# Altium schematic sheet P1.schdoc
size 420 x 298 mm; Symbol: Sheet-Symbol_A3; Company: 嘉立创EDA; Version: V1.0; Page Size: A3; @Project Name: ESP32S3_DMX_RDM_2026-06-09; @Page Count: 1; @Update Date: 2026-08-19; @Create Date: 2026-08-19; @Schematic Name: Schematic1; @Page No: 1; @Page Name: P1; Device: Sheet-Symbol_A3
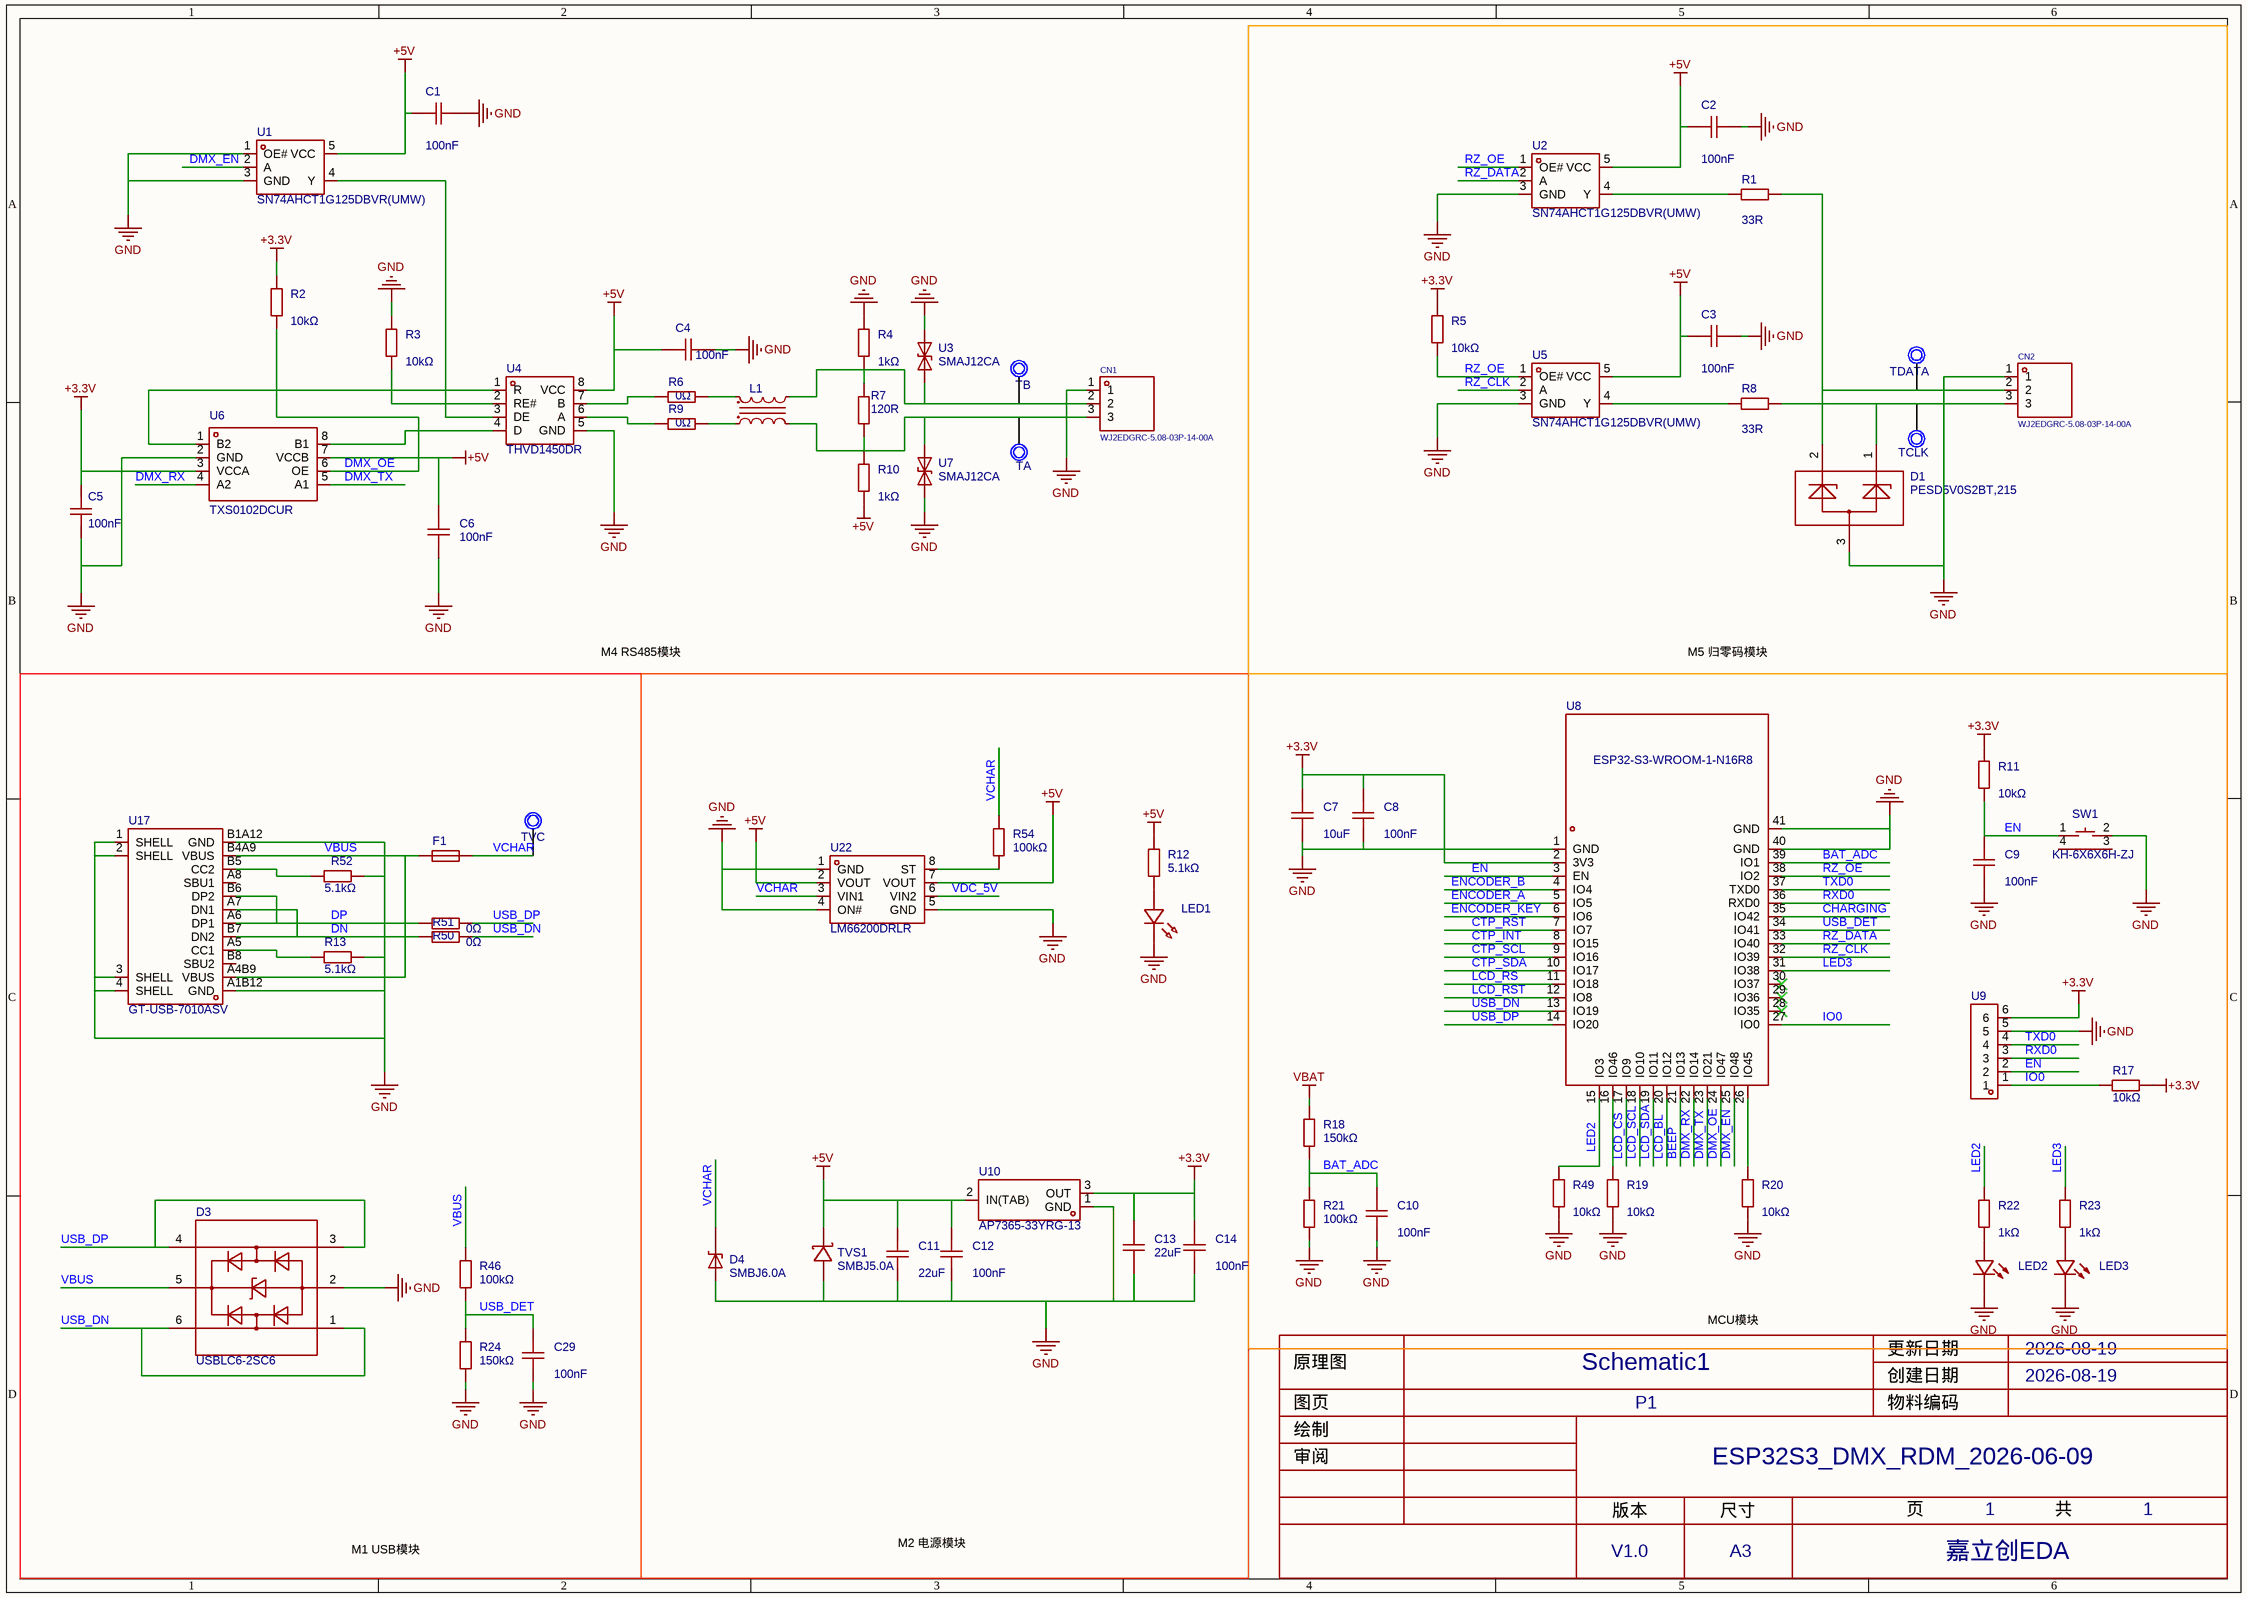
[diagram p0: P1.schdoc]

## Parts
C1  100nF  [C0805]
C2  100nF  [C0805]
C3  100nF  [C0805]
C4  100nF  [C0805]
C5  100nF  [C0805]
C6  100nF  [C0805]
C7  10uF  [C0805]
C8  100nF  [C0805]
C9  100nF  [C0805]
C10  100nF  [C0805]
C11  22uF  [C0805]
C12  100nF  [C0805]
C13  22uF  [C0805]
C14  100nF  [C0805]
C29  100nF  [C0805]
CN1  WJ2EDGRC-5.08-03P-14-00A  [CONN-TH_3P-P5.08_WJ2EDGRC-5.08-3P]
CN2  WJ2EDGRC-5.08-03P-14-00A  [CONN-TH_3P-P5.08_WJ2EDGRC-5.08-3P]
D1  PESD5V0S2BT,215  [SOT-23_L2.9-W1.3-P1.90-LS2.4-BR]
D3  USBLC6-2SC6  [SOT-23-6_L2.9-W1.6-P0.95-LS2.8-BL]
D4  SMBJ6.0A  [SMB_L4.5-W3.7-LS5.4-RD]
F1  1206L300SL16ARG  [L1206]  (value not drawn)
L1  SMW2012B900DTE  [FILTER-SMD_4P-L2.0-W1.2-BL]  (value not drawn)
LED1  MHK1375CRBTD  [LED-TH_MHK1375CRBTD]  (value not drawn)
LED2  MHK1375CGBTD  [LED-TH_MHK1375CGBTD]  (value not drawn)
LED3  MHK1375CGBTD  [LED-TH_MHK1375CGBTD]  (value not drawn)
R1  33R  [R0805]
R2  10kΩ  [R0805]
R3  10kΩ  [R0805]
R4  1kΩ  [R0805]
R5  10kΩ  [R0805]
R6  0Ω  [R0805]
R7  120R  [R0805]
R8  33R  [R0805]
R9  0Ω  [R0805]
R10  1kΩ  [R0805]
R11  10kΩ  [R0805]
R12  5.1kΩ  [R0805]
R13  5.1kΩ  [R0805]
R17  10kΩ  [R0805]
R18  150kΩ  [R0805]
R19  10kΩ  [R0805]
R20  10kΩ  [R0805]
R21  100kΩ  [R0805_NEW]
R22  1kΩ  [R0805]
R23  1kΩ  [R0805]
R24  150kΩ  [R0805]
R46  100kΩ  [R0805]
R49  10kΩ  [R0805]
R50  0Ω  [R0805]
R51  0Ω  [R0805]
R52  5.1kΩ  [R0805]
R54  100kΩ  [R0805]
SW1  KH-6X6X6H-ZJ  [SW-TH_KH-6X6X6H-ZJ-A]
TA  (no value)  [测试点]
TB  (no value)  [测试点]
TCLK  (no value)  [测试点]
TDATA  (no value)  [测试点]
TVC  (no value)  [测试点]
TVS1  SMBJ5.0A  [SMB_L4.6-W3.6-LS5.3-RD]
U1  SN74AHCT1G125DBVR(UMW)  [SOT-23-5_L3.0-W1.5-P0.95-LS2.8-BL]
U2  SN74AHCT1G125DBVR(UMW)  [SOT-23-5_L3.0-W1.5-P0.95-LS2.8-BL]
U3  SMAJ12CA  [SMA_L4.3-W2.7-LS5.1-BI]
U4  THVD1450DR  [SOIC-8_L4.9-W3.9-P1.27-LS6.0-BL]
U5  SN74AHCT1G125DBVR(UMW)  [SOT-23-5_L3.0-W1.5-P0.95-LS2.8-BL]
U6  TXS0102DCUR  [VSON8_L2.0-W2.3-P0.50-LS3.1-BL]
U7  SMAJ12CA  [SMA_L4.3-W2.7-LS5.1-BI]
U8  (no value)  [WIRELM-SMD_ESP32-S3-WROOM-1]
U9  LAIL-PZ2.54-6P-L  [CONN-TH_LAIL-PZ2.54-6P-L]  (value not drawn)
U10  AP7365-33YRG-13  [SOT-89-3_L4.5-W2.5-P1.50-LS4.2-BR]
U17  GT-USB-7010ASV  [USB-C-SMD_G-SWITCH_GT-USB-7010ASV]
U22  LM66200DRLR  [SOT-583-8_L2.1-W1.2-P0.50-LS1.6-BL]

## Blocks framed on the sheet
M5 归零码模块: C2 C3 CN2 D1 R1 R5 R8 TCLK TDATA U2 U5
M2 电源模块: C11-C14 D4 LED1 R12 R54 TVS1 U10 U22
MCU模块: C7-C10 LED2 LED3 R11 R17-R23 R49 SW1 U8 U9

## Nets
+3.3V: C5.2 C7.2 C8.2 C13.2 C14.2 R2.2 R5.2 R11.2 R17.2 U6.3(VCCA) U8.2(3V3) U9.6 U10.3(OUT)
+5V: C1.2 C2.2 C3.2 C4.1 C6.2 C11.2 C12.2 R10.1 R12.2 TVS1.1(K) U1.5(VCC) U2.5(VCC) U4.8(VCC) U5.5(VCC) U6.7(VCCB) U10.2(IN(TAB)) U22.2(VOUT) U22.7(VOUT)
GND: C1.1 C2.1 C3.1 C4.2 C5.1 C6.1 C7.1 C8.1 C9.1 C10.1 C11.1 C12.1 C13.1 C14.1 C29.1 CN1.1 CN2.1 D1.3 D3.2 D4.2(A) LED1.2(K) LED2.2(-) LED3.2(-) R3.2 R4.2 R13.2 R19.1 R20.1 R21.1 R24.1 R49.1 R52.2 SW1.2 TVS1.2(A) U1.1(OE#) U1.3(GND) U2.3(GND) U3.1(K) U4.5(GND) U5.3(GND) U6.2(GND) U7.1(K) U8.1(GND) U8.40(GND) U8.41(GND) U9.5 U10.1(GND) U17.1(SHELL) U17.2(SHELL) U17.3(SHELL) U17.4(SHELL) U17.A1B12(GND) U17.B1A12(GND) U22.1(GND) U22.4(ON#) U22.5(GND)
VBAT: R18.2
BAT_ADC: C10.2 R18.1 R21.2 U8.39(IO1)
BEEP: U8.21(IO13)
CHARGING: U8.35(IO42)
CTP_INT: U8.8(IO15)
CTP_RST: U8.7(IO7)
CTP_SCL: U8.9(IO16)
CTP_SDA: U8.10(IO17)
DMX_EN: U1.2(A) U8.25(IO48)
DMX_OE: R2.1 U6.6(OE) U8.24(IO47)
DMX_RX: U6.4(A2) U8.22(IO14)
DMX_TX: U6.5(A1) U8.23(IO21)
DN: R50.1 U17.A7(DN1) U17.B7(DN2)
DP: R51.2 U17.A6(DP1) U17.B6(DP2)
EN: C9.2 R11.1 SW1.1 U8.3(EN) U9.2
ENCODER_A: U8.5(IO5)
ENCODER_B: U8.4(IO4)
ENCODER_KEY: U8.6(IO6)
IO0: R17.1 U8.27(IO0) U9.1
LCD_BL: U8.20(IO12)
LCD_CS: U8.17(IO9)
LCD_RS: U8.11(IO18)
LCD_RST: U8.12(IO8)
LCD_SCL: U8.18(IO10)
LCD_SDA: U8.19(IO11)
LED2: R22.2 R49.2 U8.15(IO3)
LED3: R23.2 U8.31(IO38)
RXD0: U8.36(RXD0) U9.3
RZ_CLK: U5.2(A) U8.32(IO39)
RZ_DATA: U2.2(A) U8.33(IO40)
RZ_OE: R5.1 U2.1(OE#) U5.1(OE#) U8.38(IO2)
TXD0: U8.37(TXD0) U9.4
USB_DET: C29.2 R24.2 R46.1 U8.34(IO41)
USB_DN: D3.1 D3.6 R50.2 U8.13(IO19)
USB_DP: D3.3 D3.4 R51.1 U8.14(IO20)
VBUS: D3.5 F1.2 R46.2 U17.A4B9(VBUS) U17.B4A9(VBUS)
VCHAR: D4.1(K) F1.1 R54.2 TVC.1 U22.3(VIN1)
VDC_5V: U22.6(VIN2)
NetCN1_2: CN1.2 L1.4 R4.1 R7.2 TB.1 U3.2(A)
NetCN1_3: CN1.3 L1.3 R7.1 R10.2 TA.1 U7.2(A)
NetCN2_2: CN2.2 D1.2 R1.1 TDATA.1
NetCN2_3: CN2.3 D1.1 R8.1 TCLK.1
NetL1_1: L1.1 R6.1
NetL1_2: L1.2 R9.1
NetLED1_1: LED1.1(A) R12.1
NetLED2_1: LED2.1(+) R22.1
NetLED3_1: LED3.1(+) R23.1
NetR1_2: R1.2 U2.4(Y)
NetR3_1: R3.1 U1.4(Y) U4.2(RE#) U4.3(DE)
NetR6_2: R6.2 U4.7(B)
NetR8_2: R8.2 U5.4(Y)
NetR9_2: R9.2 U4.6(A)
NetR13_1: R13.1 U17.A5(CC1)
NetR19_2: R19.2 U8.16(IO46)
NetR20_2: R20.2 U8.26(IO45)
NetR52_1: R52.1 U17.B5(CC2)
NetR54_1: R54.1 U22.8(ST)
NetU4_1: U4.1(R) U6.1(B2)
NetU4_4: U4.4(D) U6.8(B1)

Not connected (* = marked no-connect by the designer): SW1 3 4; U8 28(IO35)* 29(IO36)* 30(IO37)*; U17 A8(SBU1) B8(SBU2)

## Notes on the sheet
- M4 RS485模块
- M1 USB模块
- 更新日期
- 2026-08-19
- 原理图
- 图页
- Schematic1
- P1
- 创建日期
- 物料编码
- 审阅
- 绘制
- ESP32S3_DMX_RDM_2026-06-09
- 版本
- V1.0
- 尺寸
- A3
- 页
- 1
- 嘉立创EDA
- 共

## Library data of the parts
C1-C6 C8-C10 C12 C14 C29 = CC0805KRX7R9BB104: 容值:100nF;精度:±10%;额定电压:50V;温度系数:X7R;; Manufacturer: YAGEO(国巨); Add into BOM: yes; Tolerance: ±10%; Voltage Rating: 50V; Temperature Coefficient: X7R; 3D Model: 1ba041120af144c991958decab20d241; 3D Model Transform: 78.74,51.181,0,0,0,0,0,0.0005,0; ModelName: C0805_L2.0-W1.3-H1.3; Symbol: CC0805KRX7R9BB104; Device: CC0805KRX7R9BB104; Convert to PCB: yes; LCSC Part Name: 100nF ±10% 50V; Supplier Part: C49678; Manufacturer Part: CC0805KRX7R9BB104; Supplier Footprint: 0805; JLCPCB Part Class: Basic Part; Datasheet: https://item.szlcsc.com/datasheet/CC0805KRX7R9BB104/50686.html; Supplier: LCSC; Value: 100nF; FootprintName: C0805
C7 = GRM21BR61C106KE15K: Manufacturer: muRata(村田); Add into BOM: yes; 3D Model: 1ba041120af144c991958decab20d2410819f05c4eef4c71ace90d822a990e87; 3D Model Transform: 78.74,51.181,0,0,0,0,0,0.0005,0; ModelName: C0805_L2.0-W1.3-H1.3; Symbol: GRM21BR61C106KE15K; Device: GRM21BR61C106KE15K; Convert to PCB: yes; Manufacturer Part: GRM21BR61C106KE15K; Supplier: LCSC; Supplier Part: GRM21BR61C106KE15K.1; Value: 10uF; FootprintName: C0805
C11 C13 = GRM21BR61A226ME51K: Manufacturer: muRata(村田); Add into BOM: yes; 3D Model: 1ba041120af144c991958decab20d2410819f05c4eef4c71ace90d822a990e87; 3D Model Transform: 78.74,51.181,0,0,0,0,0,0.0005,0; ModelName: C0805_L2.0-W1.3-H1.3; Symbol: GRM21BR61A226ME51K; Device: GRM21BR61A226ME51K; Convert to PCB: yes; Supplier Part: GRM21BR61A226ME51K.1; Manufacturer Part: GRM21BR61A226ME51K; Supplier: LCSC; Value: 22uF; FootprintName: C0805
CN1 CN2 = WJ2EDGRC-5.08-03P-14-00A: 连接器类型:板端/插座-闭口;固定方式:卡扣固定;结构:1x3P;间距:5.08mm;颜色:绿色;安装方式:弯插;排数:1;每排PIN数:3;额定电流:10A;额定电压:300V;线规 - AWG:-;线规 - 平方毫米:-;工作温度:-40℃~+105℃;; Manufacturer: KANGNEX(康奈克斯电气); Symbol: WJ2EDGRC-5.08-3P_C8377; Add into BOM: yes; Number of Positions or Pins: 1x3P; Pitch: 5.08mm; Number of PINs Per Row: 3; Current Rating: 10A; Voltage Rating (Max): 300V; 3D Model: 325b52b3465b4a359dace59af1924d21; 3D Model Transform: 674.802,480.314,0,0,0,0,0,-173.228,-157.48; ModelName: CONN-TH_WJ5.08-WI-3P-4; Device: WJ2EDGRC-5.08-03P-14-00A; Convert to PCB: yes; LCSC Part Name: 卡扣固定 1x3P 5.08mm 排数:1 每排P数:3; Supplier Part: C8377; Manufacturer Part: WJ2EDGRC-5.08-03P-14-00A; Supplier Footprint: 弯插,P=5.08mm; JLCPCB Part Class: Extended Part; Datasheet: https://item.szlcsc.com/datasheet/WJ2EDGRC-5.08-03P-14-00A/8871.html; Supplier: LCSC; Connector Type: 板端/插座-闭口; Termination Style: 卡扣固定; Color: 绿色; Mounting Type: 弯插; Number of Pins: 3P; Number of Rows: 1; Operating Temperature: -40℃~+105℃; Wire Gauge - AWG: -; Wire Gauge - mm2: -; Connection Type: -; Outlet Direction (Vertical Basis): -; FootprintName: CONN-TH_3P-P5.08_WJ2EDGRC-5.08-3P
D1 = PESD5V0S2BT,215: 极性:双向;反向截止电压(Vrwm):5V;钳位电压:14V;峰值脉冲电流(Ipp):12A;峰值脉冲功率(Ppp):130W@8/20us;击穿电压:5.5V;; Manufacturer: Nexperia(安世); 3D Model: c62791f0466c4ae2a892c056b845b0ca0819f05c4eef4c71ace90d822a990e87; 3D Model Transform: 98.64468,114.173,0,180,0,0,0.001,-0.002,0; Polarity: 双向; Reverse Stand-Off Voltage (Vrwm): 5V; Clamping Voltage: 14V; Peak Pulse Current (Ipp): 12A; Voltage - Breakdown: 5.5V; Reverse Leakage Current (Ir): 5nA; Number of Channels: 双路; level of protection: IEC 61000-4-5；IEC 61000-4-2; Type: ESD; Junction Capacitance: 35pF; AddInBom: yes; ModelName: SOT-23-3P_L2.9-W1.3-H1.0-LS2.4-P0.95; Symbol: PESD5V0S2BT,215; Device: PESD5V0S2BT,215; LCSC Part Name: 双向ESD; Supplier Part: C49338; Manufacturer Part: PESD5V0S2BT,215; Supplier Footprint: SOT-23; JLCPCB Part Class: Extended Part; Datasheet: https://item.szlcsc.com/datasheet/PESD5V0S2BT%252C215/50346.html; Supplier: LCSC; Peak Pulse Power Dissipation (Ppp): 130W@8/20us; ConvertToPcb: yes; FootprintName: SOT-23_L2.9-W1.3-P1.90-LS2.4-BR
D3 = USBLC6-2SC6_C7519: Manufacturer: ST(意法半导体); Add into BOM: yes; 3D Model: 18da8f6c14a34920b3e136b5c401a1190819f05c4eef4c71ace90d822a990e87; 3D Model Transform: 110.236,113.364,0,90,0,0,0.0005,0.0005,0; ModelName: SOT-23-6_L2.9-W1.6-H1.5-LS2.8-P0.95; Symbol: USBLC6-2SC6; Device: USBLC6-2SC6_C7519; Convert to PCB: yes; Supplier Part: USBLC6-2SC6.1; Manufacturer Part: USBLC6-2SC6; Supplier: LCSC; FootprintName: SOT-23-6_L2.9-W1.6-P0.95-LS2.8-BL
D4 = SMBJ6.0A_C3001967: 极性:单向;反向截止电压(Vrwm):6V;钳位电压:10.3V;峰值脉冲电流(Ipp):58.3A;峰值脉冲功率(Ppp):600W@10/1000us;击穿电压(VBR):6.67V;; Manufacturer: UMW(友台半导体); Add into BOM: yes; 3D Model: d1ae687a48d348b48f68a1373d83ebeb; 3D Model Transform: 212.598,144.488,0,0,0,0,0,0,0; Polarity: 单向; Reverse Stand-Off Voltage (Vrwm): 6V; Clamping Voltage: 10.3V; Peak Pulse Current (Ipp): 58.3A; Voltage - Breakdown: 6.67V; Reverse Leakage Current (Ir): 800uA; Number of Channels: 单路; level of protection: IEC 61000-4-4；IEC 61000-4-2; Type: TVS; Symbol: SMBJ6.0A_C3001967; Device: SMBJ6.0A_C3001967; Convert to PCB: yes; LCSC Part Name: 双向TVS 6V截止 峰值浪涌电流：58.3A; Supplier Part: C3001967; Manufacturer Part: SMBJ6.0A; Supplier Footprint: SMB(DO-214AA); JLCPCB Part Class: Extended Part; Datasheet: https://item.szlcsc.com/datasheet/SMBJ6.0A/3486674.html; Supplier: LCSC; Peak Pulse Power Dissipation (Ppp): 600W@10/1000us; Operating Temperature: -55℃~+150℃; Junction Capacitance: -; FootprintName: SMB_L4.5-W3.7-LS5.4-RD; ModelName: SMB_L4.5-W3.7-LS5.4-RD
F1 = 1206L300SL16ARG: 耐压(Vmax):16V;最大电流(Imax):50A;保持电流(Ihold):3A;跳闸电流(Itrip):6A;; Manufacturer: LUTE(陆特); Add into BOM: yes; 3D Model: 85bdab7b3d4c4074b81d208eb5e865b3; 3D Model Transform: 125.984,62.835,0,0,0,0,0,0,0; Hold Current: 3A; Trip Current: 6A; Power Dissipation: 1.2W; Resistance - Initial (Ri) (Min): 3mΩ; Resistance - Post Trip (R1) (Max): 30mΩ; Voltage - Max: 16V; Current - Max: 50A; Time to Trip(Max): 5s; ModelName: L1206_L3.2-W1.6-H1.1; Symbol: 1206L300SL16ARG; Device: 1206L300SL16ARG; Convert to PCB: yes; LCSC Part Name: 16V 3.00A 1206 低电阻自恢复自恢复; Supplier Part: C28326707; Manufacturer Part: 1206L300SL16ARG; Supplier Footprint: 1206; JLCPCB Part Class: Extended Part; Datasheet: https://item.szlcsc.com/datasheet/1206L300SL16ARG/30063183.html; Supplier: LCSC; Operating Temperature: -40℃~+85℃; Length: 3.5mm; Width: 1.85mm; Height: 1.2mm; Pitch: -; FootprintName: L1206
L1 = SMW2012B900DTE: 通道数:2;阻抗@频率:90Ω@100MHz;直流电阻(DCR):300mΩ;; Manufacturer: Sunltech(顺磁); Add into BOM: yes; Number of Lines: 2; Current Rating: 400mA; Voltage Rating - DC: 50V; Voltage Withstand: 125V; DC Resistance(DCR): 300mΩ; 3D Model: 2ee9896fb24849a1ae3ad995e0a10c07; 3D Model Transform: 79.527,47.244,0,90,0,0,0,0,0; ModelName: SMD-4_L2.0-W1.2-H1.3; Symbol: SMW2012B900DTE; Device: SMW2012B900DTE; Convert to PCB: yes; Manufacturer Part: SMW2012B900DTE; Supplier: LCSC; Supplier Part: C206236; LCSC Part Name: 两路 0805共模滤波器 阻抗90Ω@100MHz; Supplier Footprint: SMD-4P,2x1.2mm; JLCPCB Part Class: Extended Part; Datasheet: https://item.szlcsc.com/datasheet/SMW2012B900DTE/207281.html; Impedance @ Frequency: 90Ω@100MHz; Operating Temperature: -25℃~+85℃; FootprintName: FILTER-SMD_4P-L2.0-W1.2-BL
LED1 = MHK1375CRBTD: 灯头类型:-;发光颜色:红色;正向压降(Vf):2.05V;功率:75mW;正向电流:20mA;波长:628nm;二极管配置:-;透镜颜色:雾状红透镜;色温:-;发光角度:60°;载带方式:-;工作温度:-25℃~+85℃;; Manufacturer: MEIHUA(美华); 3D Model: 423a1abf1405417fac1227351b7df8de; 3D Model Transform: 181.102,334.645,0,0,0,0,0,-98.701,-137.795; Illumination Color: 红色; Voltage - Forward(Vf): 2.05V; Power(Watts): 75mW; Forward Current: 20mA; Wavelength - Dominant: 628nm; Lens Color: 雾状红透镜; Viewing Angle: 60°; AddInBom: yes; Symbol: MHK1375CRBTD; Device: MHK1375CRBTD; LCSC Part Name: 红灯; Supplier Part: C2764901; Manufacturer Part: MHK1375CRBTD; Supplier Footprint: 插件,P=2.54mm; JLCPCB Part Class: 扩展库; Datasheet: https://item.szlcsc.com/datasheet/MHK1375CRBTD/2899589.html; Supplier: LCSC; Lamp Holder Type: -; Peak Wavelength: -; Diode Configuration: -; Color Temperature: -; Mounting Style: -; Operating Temperature: -25℃~+85℃; ConvertToPcb: yes; FootprintName: LED-TH_MHK1375CRBTD; ModelName: LED-TH_MHK1375CRBTD
LED2 LED3 = MHK1375CGBTD: 灯头类型:组装式圆形灯头;发光颜色:黄绿色;功率:78mW;正向电流:20mA;主波长:568nm;二极管配置:-;透镜颜色:雾状绿透镜;色温:-;发光角度:80°;载带方式:-;工作温度:-25℃~+85℃;; Manufacturer: MEIHUA(美华); 3D Model: 6d9e9115b75148aea1bd7bdffe9c55de; 3D Model Transform: 181.102,334.645,0,0,0,0,0,-98.425,-137.795; Emitted Color: 黄绿色; Power Dissipation: 78mW; Forward Current: 20mA; Dominant Wavelength: 568nm; Lens Color: 雾状绿透镜; Viewing Angle: 80°; AddInBom: yes; ModelName: LED-TH_2P-L4.6-W8.5-H7.4-P2.54; Symbol: MHK1375CGBTD; Device: MHK1375CGBTD; LCSC Part Name: 普绿/黄绿; Supplier Part: C409769; Manufacturer Part: MHK1375CGBTD; Supplier Footprint: 插件,P=2.54mm; JLCPCB Part Class: 扩展库; Datasheet: https://atta.szlcsc.com/upload/public/pdf/source/20190807/C409769_BD2FEBD402124B53381C1A24DEF8BEC4.pdf; Supplier: LCSC; Lamp Holder Type: 组装式圆形灯头; Peak Wavelength: -; Diode Configuration: -; Color Temperature: -; Mounting Sytle: -; Operating Temperature: -25℃~+85℃; ConvertToPcb: yes; FootprintName: LED-TH_MHK1375CGBTD
R1 R8 = RC0805FR-0733RL: Manufacturer: YAGEO(国巨); Add into BOM: yes; 3D Model: 37a81e68749a4138bd2dfa6897b24b850819f05c4eef4c71ace90d822a990e87; 3D Model Transform: 78.74,51.181,0,0,0,0,0,-0.0005,0; ModelName: R0805_L2.0-W1.3-H0.6; Symbol: RC0805FR-0733RL; Device: RC0805FR-0733RL; Convert to PCB: yes; Supplier Part: RC0805FR-0733RL.1; Manufacturer Part: RC0805FR-0733RL; Supplier: LCSC; Value: 33R; FootprintName: R0805
R2 R3 R5 R11 R17 R19 R20 R49 = RC0805JR-0710KL: 电阻类型:厚膜电阻;阻值:10kΩ;精度:±5%;功率:125mW;最大工作电压:150V;温度系数:±100ppm/℃;; Manufacturer: YAGEO(国巨); Add into BOM: yes; Tolerance: ±5%; Power(Watts): 125mW; 3D Model: 37a81e68749a4138bd2dfa6897b24b85; 3D Model Transform: 78.74,51.181,0,0,0,0,0,-0.0005,0; Overload Voltage (Max): 150V; ModelName: R0805_L2.0-W1.3-H0.6; Symbol: RC0805JR-0710KL; Device: RC0805JR-0710KL; Convert to PCB: yes; LCSC Part Name: 厚膜电阻 10kΩ ±5% 125mW; Supplier Part: C100047; Manufacturer Part: RC0805JR-0710KL; Supplier Footprint: 0805; JLCPCB Part Class: Extended Part; Datasheet: https://atta.szlcsc.com/upload/public/pdf/source/20170708/1499509500945.pdf; Supplier: LCSC; Type: 厚膜电阻; Value: 10kΩ; Temperature Coefficient: ±100ppm/℃; Operating Temperature Range: -55℃~+155℃; FootprintName: R0805
R4 R10 = RC0805JR-071KL: 电阻类型:厚膜电阻;阻值:1kΩ;精度:±5%;功率:125mW;最大工作电压:150V;温度系数:±100ppm/℃;; Manufacturer: YAGEO(国巨); Add into BOM: yes; Tolerance: ±5%; Power(Watts): 125mW; Overload Voltage (Max): 150V; 3D Model: 37a81e68749a4138bd2dfa6897b24b85; 3D Model Transform: 78.74,51.181,0,0,0,0,0,-0.0005,0; ModelName: R0805_L2.0-W1.3-H0.6; Symbol: RC0805JR-071KL; Device: RC0805JR-071KL; Convert to PCB: yes; LCSC Part Name: 厚膜电阻 1kΩ ±5% 125mW; Supplier Part: C100046; Manufacturer Part: RC0805JR-071KL; Supplier Footprint: 0805; JLCPCB Part Class: Extended Part; Datasheet: https://atta.szlcsc.com/upload/public/pdf/source/20170708/1499509500945.pdf; Supplier: LCSC; Type: 厚膜电阻; Value: 1kΩ; Temperature Coefficient: ±100ppm/℃; Operating Temperature Range: -55℃~+155℃; FootprintName: R0805
R6 R9 R50 R51 = RC0805FR-070RL: 电阻类型:厚膜电阻;阻值:0Ω;精度:±1%;功率:125mW;工作电压:150V;温度系数:-;; Manufacturer: YAGEO(国巨); Add into BOM: yes; Tolerance: ±1%; Power(Watts): 125mW; 3D Model: 37a81e68749a4138bd2dfa6897b24b85; 3D Model Transform: 78.74,51.181,0,0,0,0,0,-0.0005,0; Voltage-Supply(Max): 150V; ModelName: R0805_L2.0-W1.3-H0.6; Symbol: RC0805FR-070RL; Device: RC0805FR-070RL; Convert to PCB: yes; Manufacturer Part: RC0805FR-070RL; Supplier: LCSC; Supplier Part: C100045; LCSC Part Name: 厚膜电阻 0Ω ±1% 125mW; Supplier Footprint: 0805; JLCPCB Part Class: Extended Part; Datasheet: https://item.szlcsc.com/datasheet/RC0805FR-070RL/101259.html; Type: 厚膜电阻; Value: 0Ω; Temperature Coefficient: -; Operating Temperature: -55℃~+155℃; FootprintName: R0805
R7 = RC0805FR-07120RL: Manufacturer: YAGEO(国巨); Add into BOM: yes; 3D Model: 37a81e68749a4138bd2dfa6897b24b850819f05c4eef4c71ace90d822a990e87; 3D Model Transform: 78.74,51.181,0,0,0,0,0,-0.0005,0; ModelName: R0805_L2.0-W1.3-H0.6; Symbol: RC0805FR-07120RL; Device: RC0805FR-07120RL; Convert to PCB: yes; Supplier Part: RC0805FR-07120RL.1; Manufacturer Part: RC0805FR-07120RL; Supplier: LCSC; Value: 120R; FootprintName: R0805
R12 = RC0805FR-075K1L: 电阻类型:厚膜电阻;阻值:5.1kΩ;精度:±1%;功率:125mW;工作电压:150V;温度系数:±100ppm/℃;; Manufacturer: YAGEO(国巨); Add into BOM: yes; Tolerance: ±1%; Power(Watts): 125mW; 3D Model: 37a81e68749a4138bd2dfa6897b24b85; 3D Model Transform: 78.74,51.181,0,0,0,0,0,-0.0005,0; Voltage-Supply(Max): 150V; ModelName: R0805_L2.0-W1.3-H0.6; Symbol: RC0805FR-075K1L; Device: RC0805FR-075K1L; Convert to PCB: yes; LCSC Part Name: 厚膜电阻 5.1kΩ ±1% 125mW; Supplier Part: C84375; Manufacturer Part: RC0805FR-075K1L; Supplier Footprint: 0805; JLCPCB Part Class: Extended Part; Datasheet: https://item.szlcsc.com/datasheet/RC0805FR-075K1L/85545.html; Supplier: LCSC; Type: 厚膜电阻; Value: 5.1kΩ; Temperature Coefficient: ±100ppm/℃; Operating Temperature: -55℃~+155℃; FootprintName: R0805
R13 R52 = RC0805FR-075K1L: 电阻类型:厚膜电阻;阻值:5.1kΩ;精度:±1%;功率:125mW;工作电压:150V;温度系数:±100ppm/℃;; Manufacturer: YAGEO(国巨); 3D Model: 37a81e68749a4138bd2dfa6897b24b850819f05c4eef4c71ace90d822a990e87; 3D Model Transform: 78.74,51.181,0,0,0,0,0,-0.0005,0; Tolerance: ±1%; Power(Watts): 125mW; Voltage-Supply(Max): 150V; AddInBom: yes; ModelName: R0805_L2.0-W1.3-H0.6; Symbol: RC0805FR-075K1L; Device: RC0805FR-075K1L; LCSC Part Name: 厚膜电阻 5.1kΩ ±1% 125mW; Supplier Part: C84375; Manufacturer Part: RC0805FR-075K1L; Supplier Footprint: 0805; JLCPCB Part Class: Extended Part; Datasheet: https://item.szlcsc.com/datasheet/RC0805FR-075K1L/85545.html; Supplier: LCSC; Type: 厚膜电阻; Value: 5.1kΩ; Temperature Coefficient: ±100ppm/℃; Operating Temperature: -55℃~+155℃; ConvertToPcb: yes; FootprintName: R0805
R18 R24 = RC0805FR-07150KL: 电阻类型:厚膜电阻;阻值:150kΩ;精度:±1%;功率:125mW;工作电压:150V;温度系数:±100ppm/℃;; Manufacturer: YAGEO(国巨); 3D Model: 37a81e68749a4138bd2dfa6897b24b850819f05c4eef4c71ace90d822a990e87; 3D Model Transform: 78.74,51.181,0,0,0,0,0,-0.0005,0; Tolerance: ±1%; Power(Watts): 125mW; Voltage-Supply(Max): 150V; AddInBom: yes; ModelName: R0805_L2.0-W1.3-H0.6; Symbol: RC0805FR-07150KL; Device: RC0805FR-07150KL; LCSC Part Name: 厚膜电阻 150kΩ ±1% 125mW; Supplier Part: C114558; Manufacturer Part: RC0805FR-07150KL; Supplier Footprint: 0805; JLCPCB Part Class: Extended Part; Datasheet: https://item.szlcsc.com/datasheet/RC0805FR-07150KL/115802.html; Supplier: LCSC; Type: 厚膜电阻; Value: 150kΩ; Temperature Coefficient: ±100ppm/℃; Operating Temperature: -55℃~+155℃; ConvertToPcb: yes; FootprintName: R0805
R21 = RC0805FR-07100KL: 电阻类型:厚膜电阻;阻值:100kΩ;精度:±1%;功率:125mW;工作电压:150V;温度系数:±100ppm/℃;; Manufacturer: YAGEO(国巨); Add into BOM: yes; 3D Model: 37a81e68749a4138bd2dfa6897b24b85; 3D Model Transform: 78.74,51.181,0,0,0,0,0,-0.0005,0; Tolerance: ±1%; Power(Watts): 125mW; Voltage-Supply(Max): 150V; ModelName: R0805_L2.0-W1.3-H0.6; Symbol: RC0805FR-07100KL; Device: RC0805FR-07100KL; Convert to PCB: yes; Value: 100kΩ; Supplier Footprint: 0805; LCSC Part Name: 厚膜电阻 100kΩ ±1% 125mW; Supplier Part: C96346; Manufacturer Part: RC0805FR-07100KL; JLCPCB Part Class: Extended Part; Datasheet: https://item.szlcsc.com/datasheet/RC0805FR-07100KL/97550.html; Supplier: LCSC; Type: 厚膜电阻; Temperature Coefficient: ±100ppm/℃; Operating Temperature: -55℃~+155℃; FootprintName: R0805_NEW
R22 R23 = RC0805JR-071KL: 电阻类型:厚膜电阻;阻值:1kΩ;精度:±5%;功率:125mW;最大工作电压:150V;温度系数:±100ppm/℃;; Manufacturer: YAGEO(国巨); Add into BOM: yes; Tolerance: ±5%; Power(Watts): 125mW; 3D Model: 37a81e68749a4138bd2dfa6897b24b85; 3D Model Transform: 78.74,51.181,0,0,0,0,0,-0.0005,0; Overload Voltage (Max): 150V; ModelName: R0805_L2.0-W1.3-H0.6; Symbol: RC0805JR-071KL; Device: RC0805JR-071KL; Convert to PCB: yes; LCSC Part Name: 厚膜电阻 1kΩ ±5% 125mW; Supplier Part: C100046; Manufacturer Part: RC0805JR-071KL; Supplier Footprint: 0805; JLCPCB Part Class: Extended Part; Datasheet: https://atta.szlcsc.com/upload/public/pdf/source/20170708/1499509500945.pdf; Supplier: LCSC; Type: 厚膜电阻; Value: 1kΩ; Temperature Coefficient: ±100ppm/℃; Operating Temperature Range: -55℃~+155℃; FootprintName: R0805
R46 R54 = RC0805JR-07100KL: 电阻类型:厚膜电阻;阻值:100kΩ;精度:±5%;功率:125mW;工作电压:150V;温度系数:±100ppm/℃;; Manufacturer: YAGEO(国巨); Add into BOM: yes; 3D Model: 37a81e68749a4138bd2dfa6897b24b85; 3D Model Transform: 78.74,51.181,0,0,0,0,0,-0.0005,0; Tolerance: ±5%; Power(Watts): 125mW; Voltage-Supply(Max): 150V; ModelName: R0805_L2.0-W1.3-H0.6; Symbol: RC0805JR-07100KL; Device: RC0805JR-07100KL; Convert to PCB: yes; Value: 100kΩ; Supplier Footprint: 0805; LCSC Part Name: 厚膜电阻 100kΩ ±5% 125mW; Supplier Part: C100049; Manufacturer Part: RC0805JR-07100KL; JLCPCB Part Class: Extended Part; Datasheet: https://item.szlcsc.com/datasheet/RC0805JR-07100KL/101263.html; Supplier: LCSC; Type: 厚膜电阻; Temperature Coefficient: ±100ppm/℃; Operating Temperature: -55℃~+155℃; FootprintName: R0805
SW1 = KH-6X6X6H-ZJ: 电路结构:单刀单掷;按钮形状:圆形按钮;作用力:-;安装方式:弯插;开关长度:7.5mm;开关宽度:6mm;开关高度:11.5mm;带支架:带支架;触点电流:-;额定电压:-;带灯:无;工作寿命:10万次;; Manufacturer: kinghelm(金航标); Add into BOM: yes; Circuit: 单刀单掷; Actuator Style: 圆形按钮; Switch Height: 11.5mm; with Bracket: 带支架; Actuator/Cap Color: 黑色; Life: 10万次; 3D Model: 3cf1e420a9914ace82cdace37fdf197a; 3D Model Transform: 330.708,354.33,0,0,0,0,0,-67.992,-157.48; With Lamp: 无; Symbol: KH-6X6X6H-ZJ; Device: KH-6X6X6H-ZJ; Convert to PCB: yes; Manufacturer Part: KH-6X6X6H-ZJ; Supplier: LCSC; Supplier Part: C2837542; LCSC Part Name: 7.5mm 6mm 11.5mm; Supplier Footprint: 插件; JLCPCB Part Class: Extended Part; Datasheet: https://item.szlcsc.com/datasheet/KH-6X6X6H-ZJ/3009612.html; Mounting Type: 弯插; Length: 7.5mm; Width: 6mm; Termination Style: PC引脚; Operating Force: -; Contact Current: -; Voltage Rating: -; IP Rating: -; Operating Temperature: -; FootprintName: SW-TH_KH-6X6X6H-ZJ-A; ModelName: SW-TH_KH-6X6X6H-ZJ-A
TA TB TCLK TDATA TVC = 测试点: AddInBom: yes; Symbol: 测试点; Device: 测试点; ConvertToPcb: yes; FootprintName: 测试点
TVS1 = SMBJ5.0A: Manufacturer: DOWO(东沃); Symbol: SMBJ5.0A_C357965; Add into BOM: yes; 3D Model: 5e8926c661484ff2a35b83e5ae62aeb90819f05c4eef4c71ace90d822a990e87; 3D Model Transform: 212.598,141.732,0,0,0,0,0,0,0; Device: SMBJ5.0A; Convert to PCB: yes; Supplier Part: SMBJ5.0A_C357965.1; Manufacturer Part: SMBJ5.0A; Supplier: LCSC; FootprintName: SMB_L4.6-W3.6-LS5.3-RD; ModelName: SMB_L4.6-W3.6-LS5.3-RD
U1 U2 U5 = SN74AHCT1G125DBVR(UMW): 逻辑类型:-;通道数:1;工作电压:4.5V~5.5V;静态电流(Iq):10uA;传播延迟(tpd):12ns@5V,50pF;; Manufacturer: UMW(友台半导体); 3D Model: 424d41c645fb4cc2a3598f66fad279640819f05c4eef4c71ace90d822a990e87; 3D Model Transform: 118.11,110.236,0,0,0,0,0,0,0; Number of Channels: 1; Quiescent Current: 10uA; Current - Output Low(IOL): 8mA; Input Logic Level - High: 2V; Input Logic Level - Low: 800mV; Output Logic Level - High: 4.4V；3.8V; Output Logic Level - Low: 440mV; AddInBom: yes; Symbol: SN74AHCT1G125DBVR(UMW); Device: SN74AHCT1G125DBVR(UMW); LCSC Part Name: 三态输出，单路总线缓冲门; Supplier Part: C20617903; Manufacturer Part: SN74AHCT1G125DBVR(UMW); Supplier Footprint: SOT-23-5; JLCPCB Part Class: Extended Part; Datasheet: https://item.szlcsc.com/datasheet/SN74AHCT1G125DBVR(UMW)/21992700.html; Supplier: LCSC; Logic Type: -; Voltage - Supply: 4.5V~5.5V; Current - Output High(IOH): 8mA; Series: 74AHCT; Propagation Delay: 12ns@5V,50pF; Operating Temperature: -40℃~+125℃; Input Number: 1; Features: 可控输出使能; ConvertToPcb: yes; FootprintName: SOT-23-5_L3.0-W1.5-P0.95-LS2.8-BL; ModelName: SOT-23-5_L3.0-W1.5-P0.95-LS2.8-BL
U3 U7 = SMAJ12CA_C3001959: 极性:双向;反向截止电压(Vrwm):12V;钳位电压:19.9V;峰值脉冲电流(Ipp):20.1A;峰值脉冲功率(Ppp):400W;击穿电压:13.3V;; Manufacturer: UMW(友台半导体); 3D Model: 1e67c61657434d61bdab16e34a20f5ac0819f05c4eef4c71ace90d822a990e87; 3D Model Transform: 200.787,106.299,0,0,0,0,0,0,0; Polarity: 双向; Reverse Stand-Off Voltage (Vrwm): 12V; Clamping Voltage: 19.9V; Peak Pulse Current (Ipp): 20.1A; Peak Pulse Power Dissipation (Ppp): 400W; Voltage - Breakdown: 13.3V; Reverse Leakage Current (Ir): 1uA; AddInBom: yes; Symbol: SMAJ12CA_C3001959; Device: SMAJ12CA_C3001959; LCSC Part Name: 双向TVS 12V截止 峰值脉冲电流：20.1A; Supplier Part: C3001959; Manufacturer Part: SMAJ12CA; Supplier Footprint: DO-214AC(SMA); JLCPCB Part Class: Extended Part; Datasheet: https://item.szlcsc.com/datasheet/SMAJ12CA/3486666.html; Supplier: LCSC; Type: TVS; ConvertToPcb: yes; FootprintName: SMA_L4.3-W2.7-LS5.1-BI; ModelName: SMA_L4.3-W2.7-LS5.1-BI
U4 = THVD1450DR: Manufacturer: TI(德州仪器); Add into BOM: yes; 3D Model: e81d2f7d937b4a6ab1dca543ff5d56a40819f05c4eef4c71ace90d822a990e87; 3D Model Transform: 192.913,236.22,0,0,0,0,0,0,0; ModelName: SOIC-8_L4.9-W3.9-H1.7-LS6.0-P1.27; Symbol: THVD1450DR; Device: THVD1450DR; Convert to PCB: yes; Manufacturer Part: THVD1450DR; Supplier: LCSC; Supplier Part: THVD1450DR.1; FootprintName: SOIC-8_L4.9-W3.9-P1.27-LS6.0-BL
U6 = TXS0102DCUR: Manufacturer: TI(德州仪器); Add into BOM: yes; 3D Model: 263382641c5b4ff3a87f82a73a2b65fc0819f05c4eef4c71ace90d822a990e87; 3D Model Transform: 130.141,78.74,0,270,0,0,-0.005,0.005,0; ModelName: US-8_L2.0-W2.3-H0.9-LS3.1-P0.50; Symbol: TXS0102DCUR; Device: TXS0102DCUR; Convert to PCB: yes; Supplier Part: TXS0102DCUR.1; Manufacturer Part: TXS0102DCUR; Supplier: LCSC; FootprintName: VSON8_L2.0-W2.3-P0.50-LS3.1-BL
U8 = ESP32-S3-WROOM-1-N16R8: Manufacturer: ESPRESSIF(乐鑫); Symbol: ESP32-S3-WROOM-1(N16R8); Add into BOM: yes; 3D Model: 481f5bdfc076422c9bb3c23c3ada9c170819f05c4eef4c71ace90d822a990e87; 3D Model Transform: 708.73866,1003.97437,0,0,0,0,0,143.7,0; Device: ESP32-S3-WROOM-1-N16R8; Convert to PCB: yes; Supplier Part: ESP32-S3-WROOM-1(N16R8).1; Manufacturer Part: ESP32-S3-WROOM-1-N16R8; Supplier: LCSC; FootprintName: WIRELM-SMD_ESP32-S3-WROOM-1; ModelName: WIRELM-SMD_ESP32-S3-WROOM-1
U9 = LAIL-PZ2.54-6P-L: 插针结构:1x6P;间距:2.54mm;圆针/方针:方针;排数:单排;总PIN位数:6P;额定电流:3A;额定电压:250V;塑高:2.5mm;端接针长度:3mm;触头材质:黄铜;触头镀层:金;工作温度:-25℃~+80℃;颜色:黑色;; Manufacturer: LAILAN(莱联); Add into BOM: yes; 3D Model: 78d66b34ad7c4f8faa1ccf54151694d8; 3D Model Transform: 599.999,98.8187,0,0,0,0,0,0,-118.11; Pitch: 2.54mm; Current Rating: 3A; Voltage Rating (Max): 250V; Pin Structure: 1x6P; Circluar Pins/Square Pins: 方针; Symbol: LAIL-PZ2.54-6P-L; Device: LAIL-PZ2.54-6P-L; Convert to PCB: yes; LCSC Part Name: 1x6P 间距:2.54mm 方针; Supplier Part: C54950607; Manufacturer Part: LAIL-PZ2.54-6P-L; Supplier Footprint: 插件,P=2.54mm; JLCPCB Part Class: Extended Part; Datasheet: https://item.szlcsc.com/datasheet/LAIL-PZ2.54-6P-L/58519960.html; Supplier: LCSC; Number of Rows: 单排; Insulation Height: 2.5mm; Contact Plating: 金; Operating Temperature: -25℃~+80℃; Number of Pins: 6P; Length of End Connection Pin: 3mm; Contact Material: 黄铜; Color: 黑色; FootprintName: CONN-TH_LAIL-PZ2.54-6P-L; ModelName: CONN-TH_LAIL-PZ2.54-6P-L
U10 = AP7365-33YRG-13: Manufacturer: DIODES(美台); Add into BOM: yes; 3D Model: 6db690b7897d4d18a30d90c1b89525ee0819f05c4eef4c71ace90d822a990e87; 3D Model Transform: 161.417,169.291,0,180,0,0,-11.808,0,0; ModelName: SOT-89-3_L4.3-W2.5-H1.6-LS4.1-P1.50; Symbol: AP7365-33YRG-13; Device: AP7365-33YRG-13; Convert to PCB: yes; Manufacturer Part: AP7365-33YRG-13; Supplier: LCSC; Supplier Part: AP7365-33YRG-13.1; FootprintName: SOT-89-3_L4.5-W2.5-P1.50-LS4.2-BR
U17 = GT-USB-7010ASV: 连接器类型:Type-C;协议标准:USB 2.0;公母:母;安装方式:卧贴;触点数量:16P;端口数量:1;额定电流 - 电源:3A;工作温度:-40℃~+85℃;; Manufacturer: G-Switch(品赞); AddInBom: yes; ModelId: f185ae662725428a9073ef0181ffed890819f05c4eef4c71ace90d822a990e87; ModelTransform: 351.9678,311.023,0,0,0,0,0,-41.339,-59.055; Connector Type: Type-C; Protocol Standard: USB 2.0; Gender: 母; Number of Contacts: 16P; Number of Ports: 1; Current Rating-Power: 3A; Voltage Rating: 24V; Connect-Disconnect Life: 1万次; Center Height: 1.68mm; Detection color: 黑色; Symbol: GT-USB-7010ASV; Device: GT-USB-7010ASV; LCSC Part Name: Type-C 母 卧贴; SupplierPart: C2988369; ManufacturerPart: GT-USB-7010ASV; Supplier Footprint: SMD; JLCPCB Part Class: Extended Part; Datasheet: https://item.szlcsc.com/datasheet/GT-USB-7010ASV/3445595.html; Supplier: LCSC; ConvertToPcb: yes; FootprintName: USB-C-SMD_G-SWITCH_GT-USB-7010ASV; ModelName: USB-C-SMD_G-SWITCH_GT-USB-7010ASV; Mounting Type: 卧贴; Length: 7.35mm; Operating Temperature: -40℃~+85℃
U22 = LM66200DRLR: LM66200 1.6V 至 5.5V、40mΩ、2.5A、低 IQ、双输入理想二极管; Manufacturer: TI(德州仪器); AddInBom: yes; ModelId: 14eb3df1056d4df2aac7ceeb7e81e7380819f05c4eef4c71ace90d822a990e87; ModelTransform: 82.677,62.992,0,0,0,0,0,0,0; Input Voltage (Vin): 1.6V~5.5V; Number of Channels: 2; RDS(on): 74mΩ; Quiescent Current: 1.32uA; Symbol: LM66200DRLR; Device: LM66200DRLR; LCSC Part Name: 1.6V至5V、2.5A双理想二极管，具有自动切换功能; SupplierPart: C3235556; ManufacturerPart: LM66200DRLR; Supplier Footprint: SOT-583; JLCPCB Part Class: Extended Part; Datasheet: https://www.ti.com/cn/lit/ds/symlink/lm66200.pdf; Supplier: LCSC; ConvertToPcb: yes; FootprintName: SOT-583-8_L2.1-W1.2-P0.50-LS1.6-BL; ModelName: SOT-583-8_L2.1-W1.2-P0.50-LS1.6-BL; Operating Temperature: -40℃~+125℃; Features: 过温保护；带使能；反向电流阻断